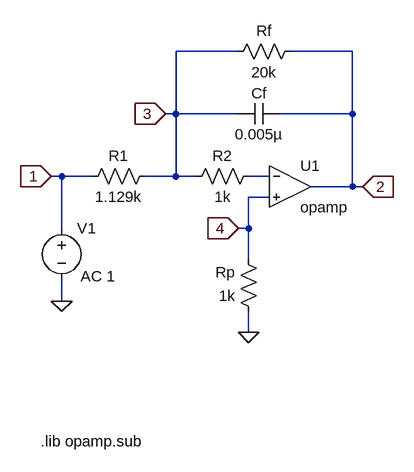
[diagram p0: schematic Draft2.asc]
Draft2.asc, the LTspice schematic file:
Version 4
SHEET 1 880 680
WIRE 288 -112 192 -112
WIRE 464 -112 368 -112
WIRE 192 -16 192 -112
WIRE 192 -16 176 -16
WIRE 288 -16 192 -16
WIRE 464 -16 464 -112
WIRE 464 -16 352 -16
WIRE 16 80 0 80
WIRE 64 80 16 80
WIRE 192 80 192 -16
WIRE 192 80 144 80
WIRE 224 80 192 80
WIRE 336 80 304 80
WIRE 464 96 464 -16
WIRE 464 96 400 96
WIRE 480 96 464 96
WIRE 336 112 304 112
WIRE 16 160 16 80
WIRE 304 160 304 112
WIRE 304 160 288 160
WIRE 304 208 304 160
WIRE 16 272 16 240
WIRE 304 320 304 288
FLAG 304 320 0
FLAG 16 272 0
FLAG 0 80 1
IOPIN 0 80 In
FLAG 480 96 2
IOPIN 480 96 In
FLAG 288 160 4
IOPIN 288 160 In
FLAG 176 -16 3
IOPIN 176 -16 In
SYMBOL voltage 16 144 R0
WINDOW 123 29 90 Left 2
WINDOW 39 0 0 Left 0
SYMATTR InstName V1
SYMATTR Value ""
SYMATTR Value2 AC 1
SYMBOL OpAmps\\opamp 368 32 R0
SYMATTR InstName U1
SYMBOL res 160 64 R90
WINDOW 0 0 56 VBottom 2
WINDOW 3 32 56 VTop 2
SYMATTR InstName R1
SYMATTR Value 1.129k
SYMBOL res 320 64 R90
WINDOW 0 0 56 VBottom 2
WINDOW 3 32 56 VTop 2
SYMATTR InstName R2
SYMATTR Value 1k
SYMBOL res 320 304 R180
WINDOW 0 36 76 Left 2
WINDOW 3 36 40 Left 2
SYMATTR InstName Rp
SYMATTR Value 1k
SYMBOL res 272 -96 R270
WINDOW 0 32 56 VTop 2
WINDOW 3 0 56 VBottom 2
SYMATTR InstName Rf
SYMATTR Value 20k
SYMBOL cap 352 -32 R90
WINDOW 0 0 32 VBottom 2
WINDOW 3 32 32 VTop 2
SYMATTR InstName Cf
SYMATTR Value 0.005µ
TEXT -16 488 Left 2 !.lib opamp.sub

The netlist it stands for:
* Draft2.asc
V1 1 0 AC 1
XU1 N001 4 2 opamp Aol=100K GBW=10Meg  ; pins invin noninvin out
R1 3 1 1.129k
R2 N001 3 1k
Rp 0 4 1k
Rf 3 2 20k
Cf 2 3 0.005µ
.lib opamp.sub
.backanno
.end